# Altium project Can.PrjPcb
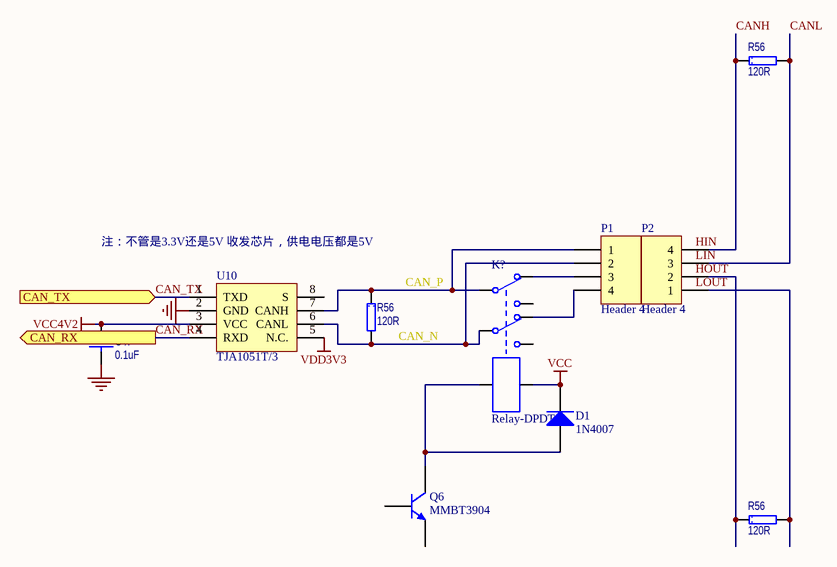
[diagram p0: can-面板.SchDoc]
2 sheets, 26 parts. Net scope: flat (ports and power ports of the same name join across sheets).
Sheets:
  can-面板.SchDoc
  can-1.SchDoc

## Sheet can-面板.SchDoc
size A4

### Parts
(Parts that share a designator on the sheet are numbered #1, #2 ... from top to bottom, then left to right.)
C47  0.1uF  [2012[0805]06CD]
D1  1N4007  [DO-214AC/SMA]
K?#1  Relay-DPDT  [DIP-P8/E10]
P1  Header 4  [HDR1X4]
P2  Header 4  [HDR1X4]
Q6  MMBT3904  [SOT23_N]
R56#1  120R  [2012[0805]R]
R56#2  120R  [2012[0805]R]
R56#3  120R  [2012[0805]R]
U10  TJA1051T/3  [SOIC8_N]

### Ports
CAN_RX (out), CAN_TX (in)

### Nets
GND: C47.2 U10.2(GND)
VCC: D1.2(K) K?#1.8
VCC4V2: C47.1 U10.3(VCC)
VDD3V3: U10.5(N.C.)
CAN_N: K?#1.4 P1.2 R56#2.2 U10.6(CANL)
CAN_P: K?#1.1 P1.1 R56#2.1 U10.7(CANH)
CAN_RX: U10.4(RXD) ; port CAN_RX
CAN_TX: U10.1(TXD) ; port CAN_TX
CANH: P2.4 R56#1.1
CANL: P2.3 R56#1.2
NetD1_1: D1.1(A) K?#1.7 Q6.3(C)
NetK?#1_2: K?#1.2 P1.3
NetK?#1_5: K?#1.5 P1.4
NetP2_1: P2.1 R56#3.2
NetP2_2: P2.2 R56#3.1

Not connected (* = marked no-connect by the designer): K?#1 3 6; Q6 1(B) 2(E); U10 8(S)

### Notes on the sheet
- (near U10) 注：不管是3.3V还是5V 收发芯片，供电电压都是5V
- Labels drawn without touching a wire or pin: HIN, HOUT, LIN, LOUT

### Library data of the parts
C47 = CAP: Capacitor; Manufacturer: TDK; Type: 无铅电容; Model: C0603X7R1H104K; Value: 0.1uF
D1 = 1N4007: 1.0 Ampere General Purpose Rectifier; Published: 8-Jun-2000; LatestRevisionDate: 17-Jul-2002; LatestRevisionNote: Re-released for DXP Platform.; DatasheetDocument: 1998; PackageDocument: Aug-1999; PackageReference: DO-41; Publisher: Altium Limited; Code_JEDEC: DO-204-AL; ComponentLink1Description: Manufacturer Link; ComponentLink1URL: http://www.fairchildsemi.com/; ComponentLink2Description: Pinout Specification; ComponentLink2URL: http://www.fairchildsemi.com/ds/1N%2F1N4001.pdf
K?#1 = Relay-DPDT: Dual-Pole Dual-Throw Relay; Published: 24-Mar-1999; LatestRevisionDate: 17-Jul-2002; LatestRevisionNote: Re-released for DXP Platform.; PackageReference: DIP-P8; Publisher: Altium Limited
P1 P2 = Header 4: Header, 4-Pin; LatestRevisionDate: 17-Jul-2002; LatestRevisionNote: Re-released for DXP Platform.; Publisher: Altium Limited
Q6 = MMBT3904: NPN Switching Transistor; Published: 17-Sep-2003; LatestRevisionDate: 12-Dec-2006; LatestRevisionNote: IPC-7351 Footprint Added.; DatasheetVersion: 13-May-2002; PackageVersion: May-1999; PackageReference: SOT23; Publisher: Altium Limited; PackageDescription: 3-Pin SOT-23 Package 0.95 mm Pitch, 2.3 mm Lead Span; ComponentLink1Description: Manufacturer Link; ComponentLink1URL: http://www.semiconductors.philips.com/; ComponentLink2Description: Datasheet; ComponentLink2URL: http://www.semiconductors.philips.com/acrobat/datasheets/MMBT3904_4.pdf
R56#1-R56#3 = RES: Manufacturer: vishay; Model: RT0603DRD7D120RL; Value: 120R; Type: 无铅电阻
U10 = TJA1051T/3: IC; 公司: NXP

## Sheet can-1.SchDoc
size A0
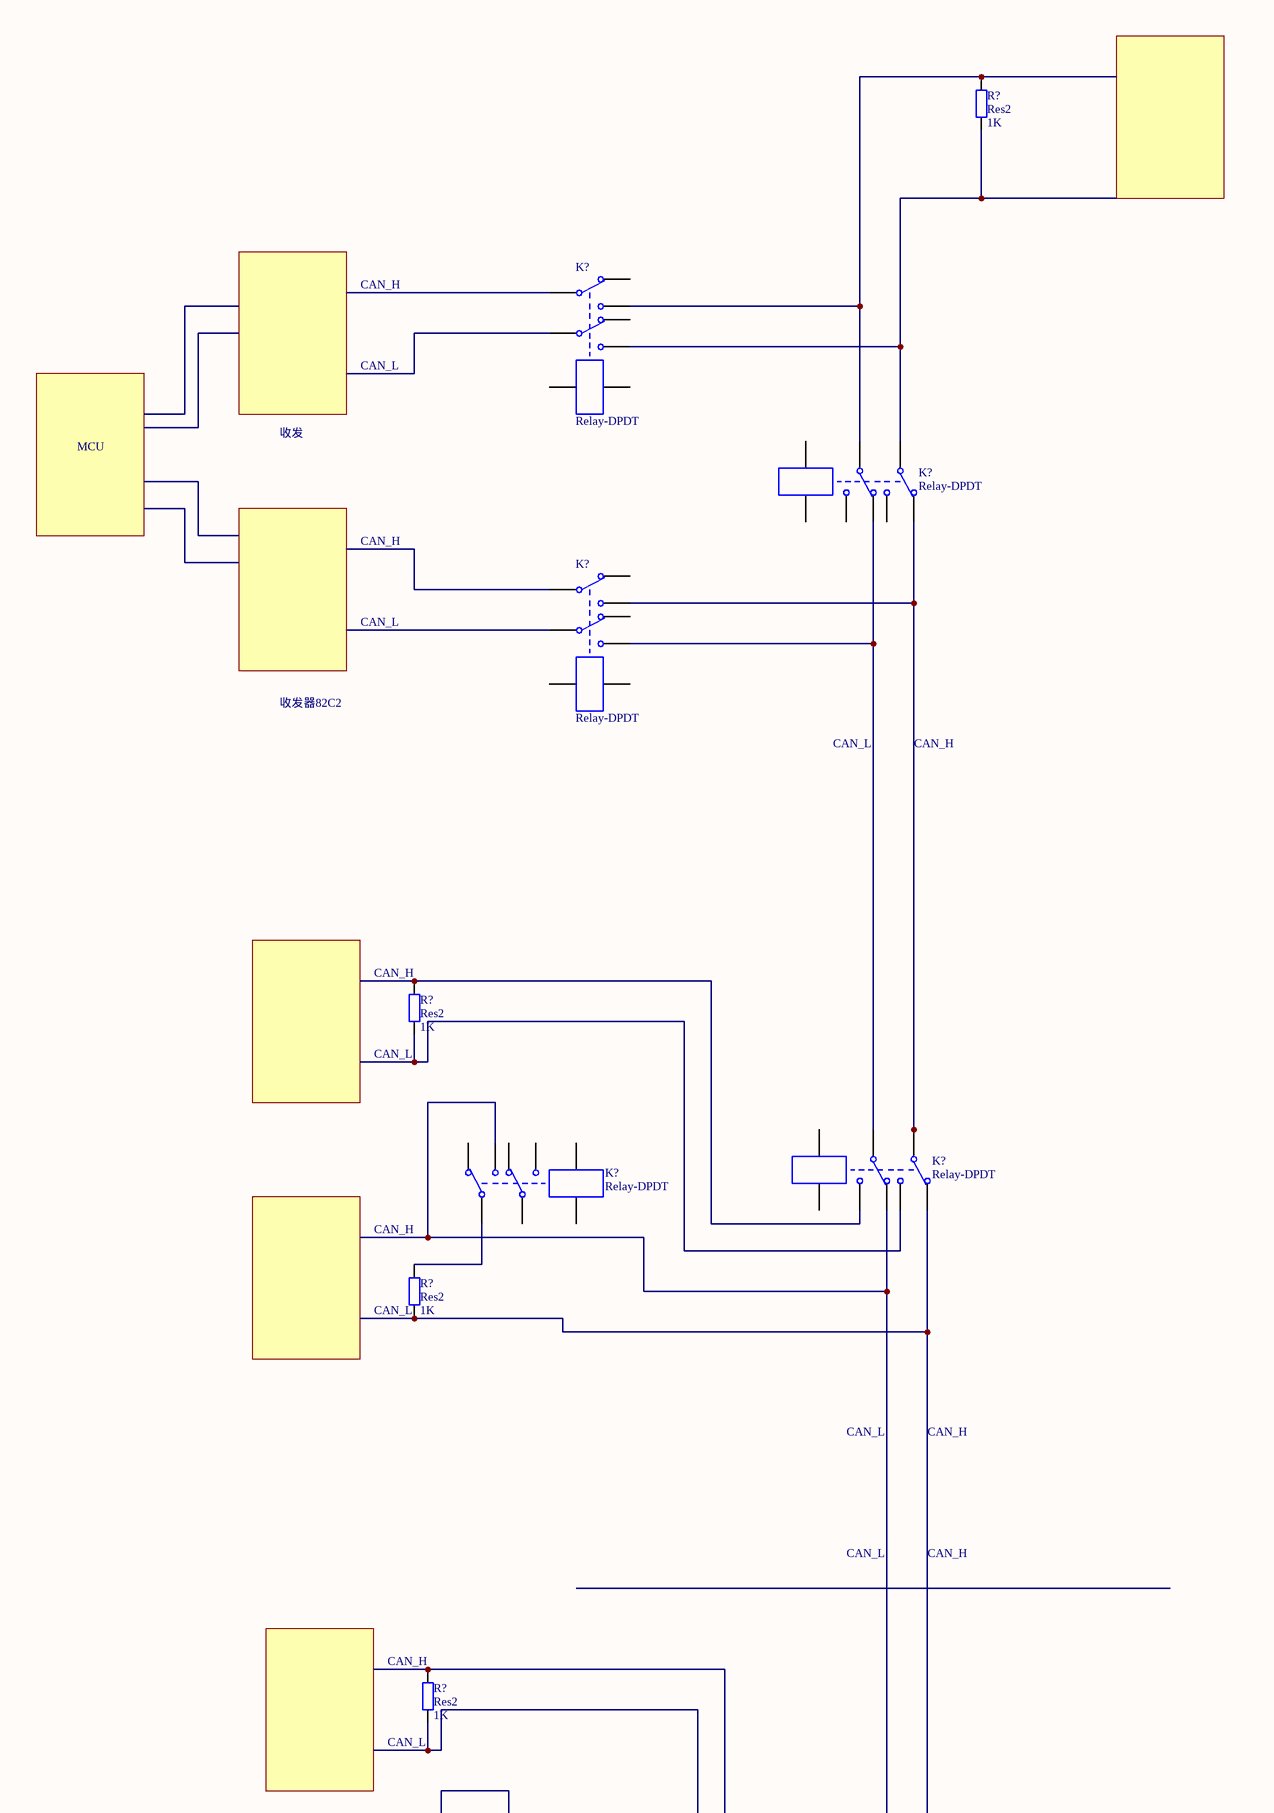
[diagram p1: can-1.SchDoc, top]
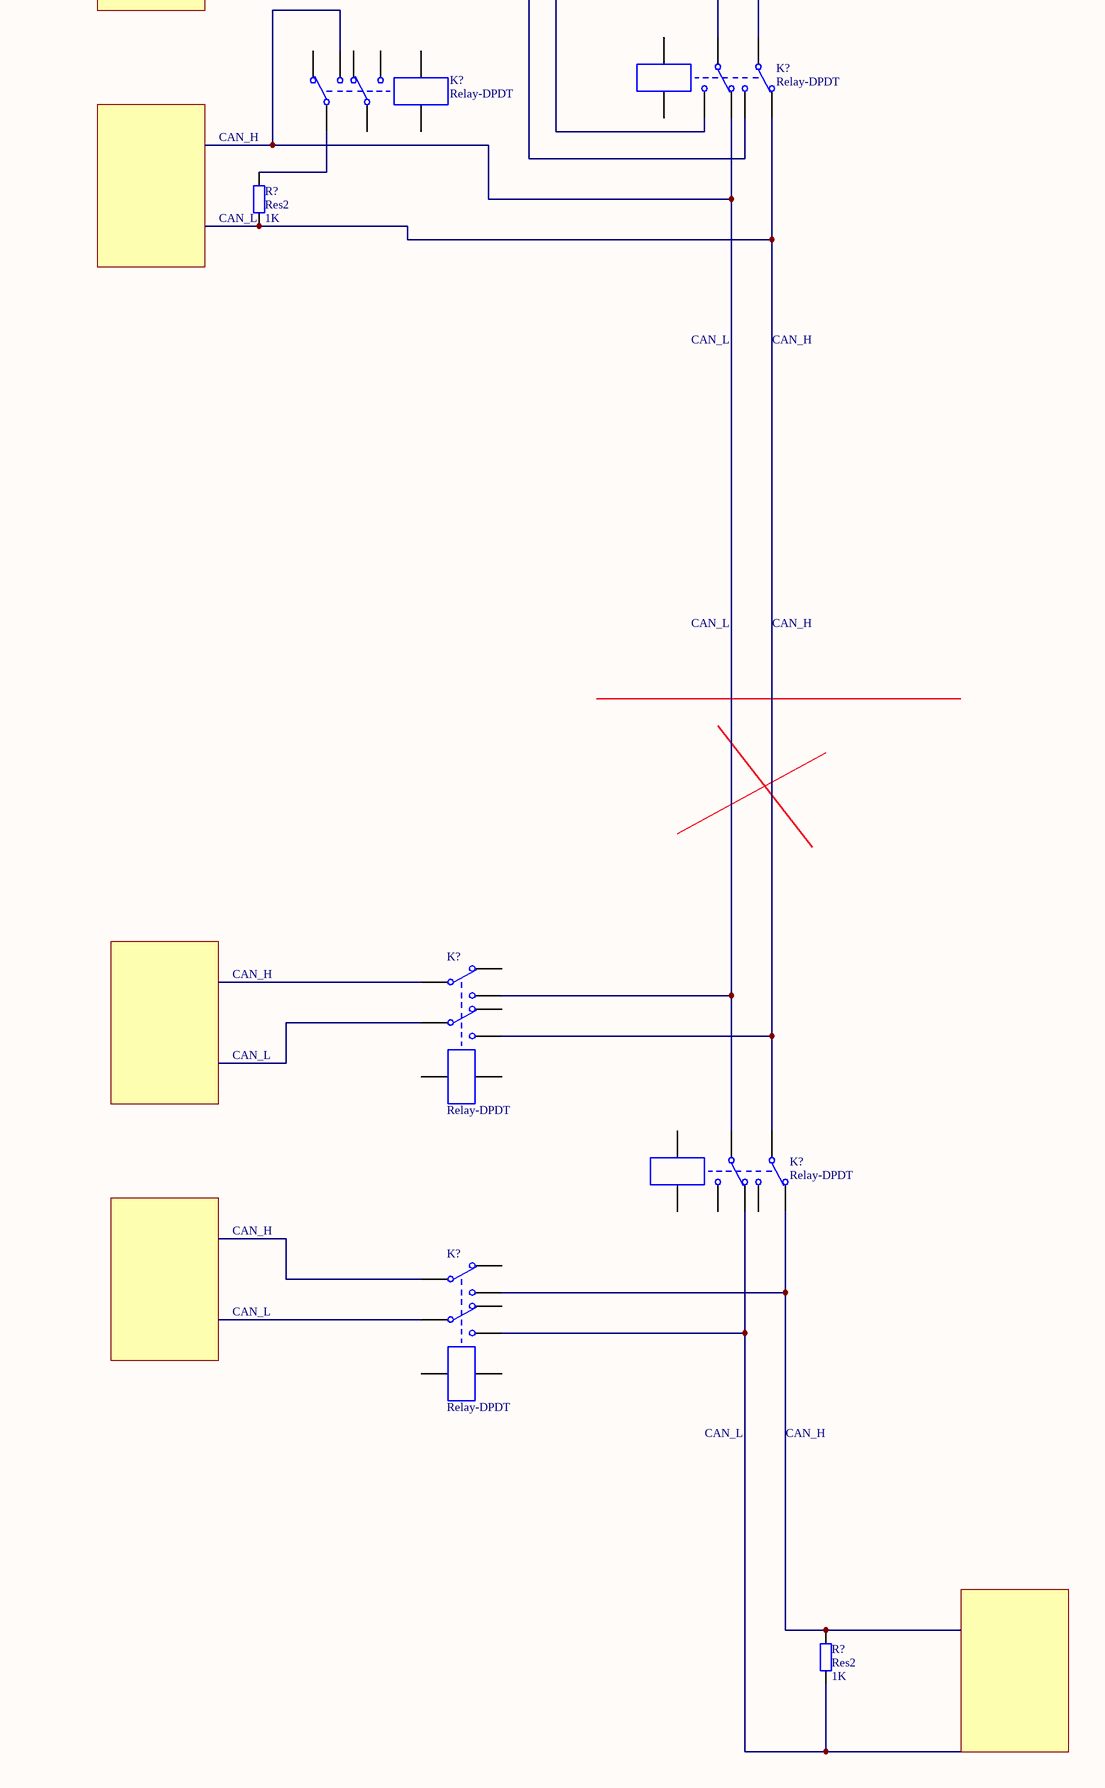
[diagram p2: can-1.SchDoc, bottom]

### Parts
(Parts that share a designator on the sheet are numbered #1, #2 ... from top to bottom, then left to right.)
K?#2  Relay-DPDT  [DIP-P8]
K?#3  Relay-DPDT  [DIP-P8]
K?#4  Relay-DPDT  [DIP-P8]
K?#5  Relay-DPDT  [DIP-P8]
K?#6  Relay-DPDT  [DIP-P8]
K?#7  Relay-DPDT  [DIP-P8]
K?#8  Relay-DPDT  [DIP-P8]
K?#9  Relay-DPDT  [DIP-P8]
K?#10  Relay-DPDT  [DIP-P8]
K?#11  Relay-DPDT  [DIP-P8]
R?#1  Res2  value 1K  [AXIAL-0.4]
R?#2  Res2  value 1K  [AXIAL-0.4]
R?#3  Res2  value 1K  [AXIAL-0.4]
R?#4  Res2  value 1K  [AXIAL-0.4]
R?#5  Res2  value 1K  [AXIAL-0.4]
R?#6  Res2  value 1K  [AXIAL-0.4]

### Nets
NetK?#2_3: K?#2.3 K?#3.4 R?#1.2
NetK?#2_6: K?#2.6 K?#3.1 R?#1.1
NetK?#3_2: K?#3.2 K?#4.3 K?#5.1
NetK?#3_5: K?#3.5 K?#4.6 K?#5.4
NetK?#5_2: K?#5.2 K?#7.1 R?#3.1
NetK?#5_3: K?#5.3 R?#2.1
NetK?#5_5: K?#5.5 K?#6.3 K?#7.4
NetK?#5_6: K?#5.6 R?#2.2
NetK?#6_1: K?#6.1 R?#3.2
NetK?#7_2: K?#7.2 K?#9.6 K?#10.1 R?#5.1
NetK?#7_3: K?#7.3 R?#4.1
NetK?#7_5: K?#7.5 K?#8.3 K?#9.3 K?#10.4
NetK?#7_6: K?#7.6 R?#4.2
NetK?#8_1: K?#8.1 R?#5.2
NetK?#10_2: K?#10.2 K?#11.3 R?#6.2
NetK?#10_5: K?#10.5 K?#11.6 R?#6.1

Not connected (* = marked no-connect by the designer): K?#2 1 2 4 5 7 8; K?#3 3 6 7 8; K?#4 1 2 4 5 7 8; K?#5 7 8; K?#6 2 4 5 6 7 8; K?#7 7 8; K?#8 2 4 5 6 7 8; K?#9 1 2 4 5 7 8; K?#10 3 6 7 8; K?#11 1 2 4 5 7 8

### Notes on the sheet
- CAN_H
- CAN_L
- MCU
- 收发
- 收发器82C2
- (near R?#2) CAN_H
- (near R?#2) CAN_L
- (near R?#3) CAN_H
- (near R?#3) CAN_L
- (near R?#4) CAN_H
- (near R?#4) CAN_L
- (near R?#5) CAN_H
- (near R?#5) CAN_L

### Library data of the parts
K?#2-K?#11 = Relay-DPDT: Dual-Pole Dual-Throw Relay; Published: 24-Mar-1999; LatestRevisionDate: 17-Jul-2002; LatestRevisionNote: Re-released for DXP Platform.; PackageReference: DIP-P8; Publisher: Altium Limited; PackageDescription: Relay; 8 Leads
R?#1-R?#6 = Res2: Resistor; Published: 8-Jun-2000; LatestRevisionDate: 17-Jul-2002; LatestRevisionNote: Re-released for DXP Platform.; PackageReference: AXIAL-0.4; Publisher: Altium Limited; PackageDescription: Axial Device, Thru-Hole; 2 Leads; 0.4 in Pin Spacing